# EAGLE design ConverterBoard (EAGLE 6.5.0)
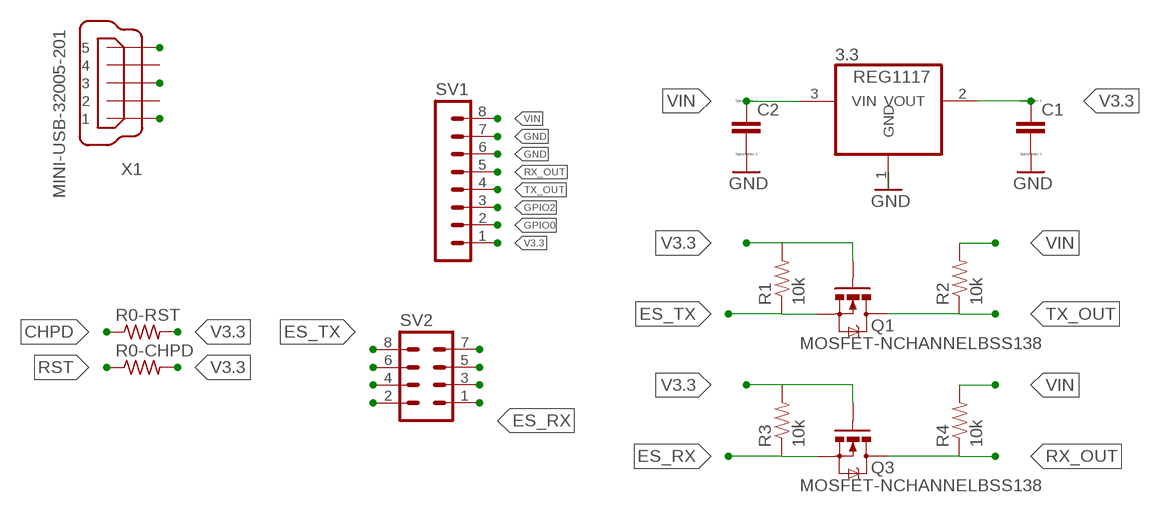
[diagram p0: schematic, sheet 1]

## Parts
3.3  REG1117  [SOT223]
C1  CC1808  [C1808]
C2  CC1808  [C1808]
Q1  MOSFET-NCHANNELBSS138  [SOT23-3]
Q3  MOSFET-NCHANNELBSS138  [SOT23-3]
R0-CHPD  R-US_R0603  [R0603]
R0-RST  R-US_R0603  [R0603]
R1  10k  RESISTOR0805-RES  [0805]
R2  10k  RESISTOR0805-RES  [0805]
R3  10k  RESISTOR0805-RES  [0805]
R4  10k  RESISTOR0805-RES  [0805]
SV1  MA08-1  [MA08-1]
SV2  MA04-2  [MA04-2]
X1  MINI-USB-32005-201  [32005-201]

## Nets
CHPD: R0-RST.1 SV2.6
ES_RX: Q3.2(S) R3.1 SV2.1
ES_TX: Q1.2(S) R1.1 SV2.8
GND: 3.3.1(GND) C1.2 C2.2 SV1.6 SV1.7 SV2.7 X1.5
GPIO0: SV1.2 SV2.3
GPIO2: SV1.3 SV2.5
N$3: X1.3
RST: R0-CHPD.1 SV2.4
RX_OUT: Q3.3(D) R4.1 SV1.5
TX_OUT: Q1.3(D) R2.1 SV1.4
V3.3: 3.3.2(VOUT) C1.1 Q1.1(G) Q3.1(G) R0-CHPD.2 R0-RST.2 R1.2 R3.2 SV1.1 SV2.2
VIN: 3.3.3(VIN) C2.1 R2.2 R4.2 SV1.8 X1.1
Unconnected: X1.2 X1.4

## Library data of the parts
3.3 = burr-brown:REG1117: 800mA and 1A Low Dropout (LDO) Positive Regulator 1.8V, 2.5V, 2.85V, 3.3V, 5V, and Adj; MPN: REG1117; OC_FARNELL: 1097566; OC_NEWARK: 14P6981
C1 C2 = eagle-ltspice:C: CAPACITOR, European symbol; SPICEMODEL: NONE; SPICEPREFIX: C
Q1 Q3 = SparkFun-DiscreteSemi:MOSFET-NCHANNEL: Common NMOSFET Parts MFG P/N Store ID Prod ID FDD8780 TRANS-09984 SI7820DN TRANS-11055 FDS6630A IC-08089 2N7002PW TRANS-11151 FQP30N06L COM-10213 TRANS-10060 BSS123LT1G TRANS-08345 BSS138 TRANS-00830 BS170 2N7000; PROD_ID: TRANS-00830
R0-CHPD R0-RST = resistor:R-US_: RESISTOR, American symbol
R1-R4 = SparkFun-Passives:RESISTOR: Resistor Basic schematic elements and footprints for 0603, 1206, and PTH resistors.
SV1 = con-lstb:MA08-1: PIN HEADER; OC_FARNELL: unknown; OC_NEWARK: unknown
SV2 = con-lstb:MA04-2: PIN HEADER; OC_FARNELL: unknown; OC_NEWARK: unknown
X1 = con-cypressindustries:MINI-USB-: MINI USB-B Conector Source: www.cypressindustries.com; OC_FARNELL: unknown; OC_NEWARK: unknown

## Board
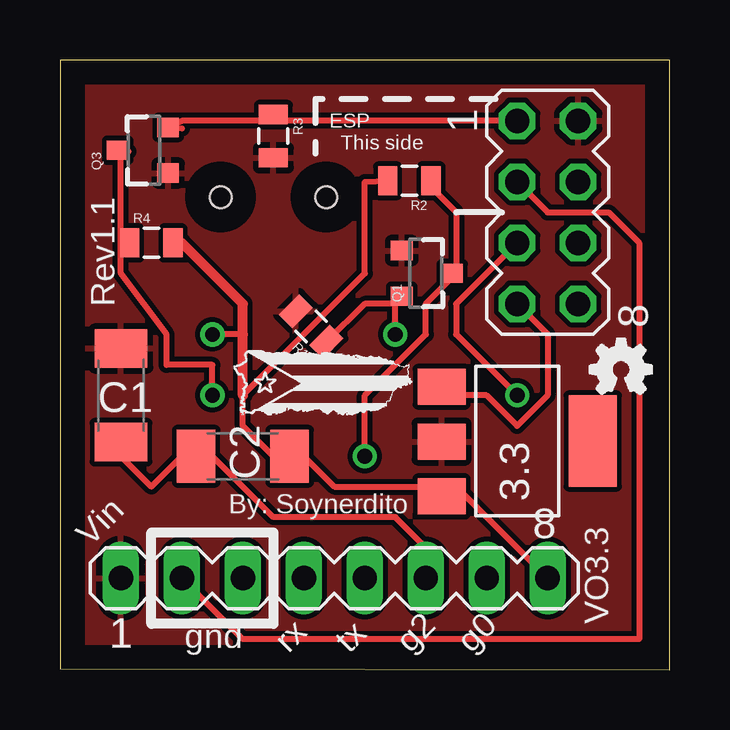
[diagram p1: board, top side]
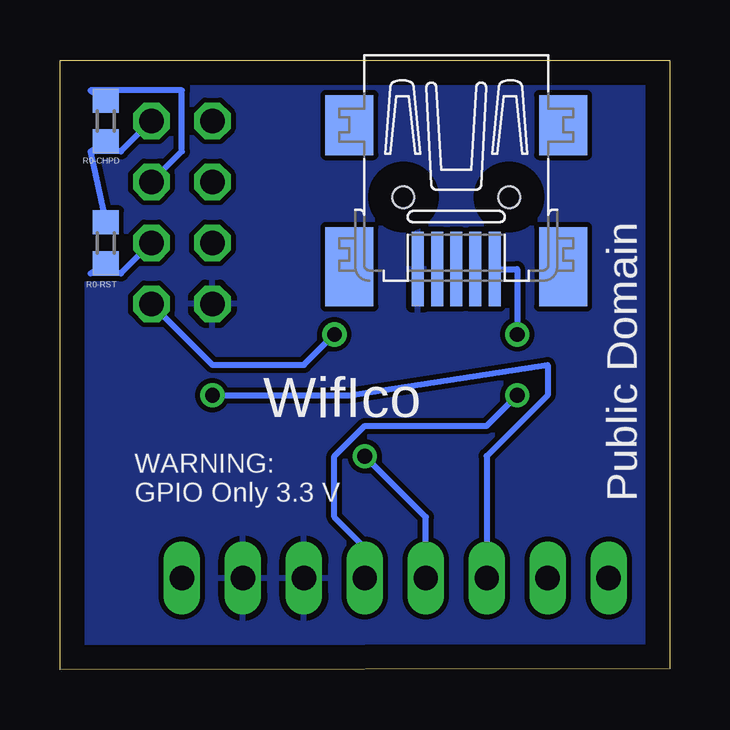
[diagram p2: board, bottom side, seen from below]

Size 25.4 x 25.4 mm. Coordinates in mm from the lower left corner, seen from the top.
Outline: 0,0.03 25.4,0 25.4,25.4 0,25.4 0,0.03
Copper layers (1*16): Top 0.035mm / dielectric 1.5mm / Bottom 0.035mm
Design rules "default": minimum track width 10mil, minimum drill 24mil, track to track 8mil, track to pad 8mil, pad to pad 8mil, via to via 8mil, smd to smd 8mil, copper to edge 40mil, drill to drill 8mil, minimum pad ring 10mil, minimum via ring 8mil, stop-mask expansion 4mil, vias tented up to drill 0mil, thermal gap 10mil

### Footprints (pad centres in the part's own frame; a part is rotated, then mirrored left to right if it is on the bottom)
SOT223 = smd 1.499 x 2.007: 1 -2.261,-3.15; 2 0.025,-3.15; 3 2.311,-3.15 | smd 3.81 x 2.007: 4 0,3.15
C1808 = smd 1.6 x 2.2: 1 -1.95,0; 2 1.95,0
SOT23-3 = smd 0.8 x 0.9: 1 -0.95,-1; 2 0.95,-1; 3 0,1.1
R0603 = smd 1 x 1.1: 1 -0.85,0; 2 0.85,0
0805 = smd 0.8 x 1.2: 1 -0.9,0; 2 0.9,0
MA08-1 = drill 1.016 long: 1 -8.89,0; 2 -6.35,0; 3 -3.81,0; 4 -1.27,0; 5 1.27,0; 6 3.81,0; 7 6.35,0; 8 8.89,0
MA04-2 = drill 1.016 octagon: 1 -3.81,-1.27; 2 -3.81,1.27; 3 -1.27,-1.27; 4 -1.27,1.27; 5 1.27,-1.27; 6 1.27,1.27; 7 3.81,-1.27; 8 3.81,1.27
32005-201 = smd 3.1 x 0.5: 1 3,1.6; 2 3,0.8; 3 3,0; 4 3,-0.8; 5 3,-1.6 | smd 2.5 x 2: M1 -3,-4.45; M2 -3,4.45 | smd 3.3 x 2: M3 2.9,4.45; M4 2.9,-4.45 | hole 0.9: 0,2.2; 0,-2.2

### Placement (x,y rotation side)
3.3  19.05,9.53 270 top
C1  2.54,11.43 270 top
C2  7.62,8.89 180 top
Q1  15.24,16.51 270 top
Q3  3.51,21.64 90 top
R0-CHPD  23.5,22.86 270 bottom
R0-RST  23.5,17.78 90 bottom
R1  10.46,14.3 135 top
R2  14.55,20.37 180 top
R3  8.89,22.23 270 top
R4  3.81,17.78 0 top
SV1  11.43,3.81 0 top
SV2  20.32,19.05 270 top
X1  8.89,19.68 270 bottom

### Tracks (layer width: path | path; a pad name or v marks a point on that pad's centre or on a via)
CHPD
  Bottom 0.254: SV2.6 22.86,16.51 24.13,16.51 R0-RST.1
ES_RX
  Top 0.254: 5.08,22.54 Q3.2 5.08,22.86 8.89,22.86 | SV2.1 8.89,22.86 | 8.89,22.86 R3.1
ES_TX  (via drill 0.61)
  Top 0.254: v13.97,13.97 13.97,15.24 | 13.97,15.24 12.7,15.24 R1.1 | 13.97,15.24 Q1.2
  Bottom 0.254: v13.97,13.97 15.24,12.7 19.05,12.7 SV2.8
GND
  Top 0.254: C1.2 2.54,8.89 3.81,7.62 5.08,8.89 C2.2 6.35,8.89 8.89,6.35 13.97,6.35 15.24,5.08 SV1.6 | SV2.7 20.32,13.97 20.32,11.43 19.05,10.16 17.78,11.43 16.51,11.43 3.3.1
  pour Bottom: 0,25.4 0,0 25.4,0 25.4,25.4
GPIO0
  Top 0.254: SV1.2 7.62,1.27 24.13,1.27 24.13,17.78 22.86,19.05 20.32,19.05 SV2.3
GPIO2  (via drill 0.61)
  Top 0.254: v19.05,11.43 16.51,13.97 16.51,15.24 SV2.5
  Bottom 0.254: SV1.3 7.62,8.89 5.08,11.43 5.08,12.7 13.34,11.43 v19.05,11.43
RST
  Bottom 0.254: SV2.4 20.32,21.59 20.32,24.13 24.13,24.13 R0-CHPD.1
RX_OUT  (via drill 0.61)
  Top 0.254: 2.86,21.59 Q3.3 2.54,21.59 2.54,17.78 | 2.86,17.78 R4.1 2.54,17.78 | 2.54,17.78 2.54,16.51 4.45,13.97 4.45,12.7 6.35,12.7 v6.35,11.43
  Bottom 0.254: v6.35,11.43 7.62,10.16 12.7,10.16 13.97,8.89 13.97,6.35 12.7,5.08 SV1.5
TX_OUT  (via drill 0.61)
  Top 0.254: 16.51,16.51 16.51,19.05 15.24,20.32 R2.1 | 16.51,16.51 15.24,15.24 15.24,13.97 12.7,11.43 v12.7,8.89 | 16.51,16.51 Q1.3
  Bottom 0.254: v12.7,8.89 10.16,6.35 SV1.4
V3.3
  Bottom 0.254: 24.13,21.59 R0-RST.2 | 24.13,21.59 22.86,21.59 SV2.2 | 24.13,21.59 R0-CHPD.2
  pour Top: 0,25.4 0,0 25.4,0 25.4,25.4
VIN  (via drill 0.61)
  Top 0.254: 5.08,17.78 R4.2 | R2.2 12.7,20.32 12.7,16.51 7.62,11.43 7.62,10.16 8.89,8.89 C2.1 10.16,8.89 11.43,7.62 15.24,7.62 3.3.3 16.51,7.62 SV1.8 | 7.62,13.97 v6.35,13.97
  Top 0.406: 5.08,17.78 7.62,15.24 7.62,13.97 7.62,11.43
  Bottom 0.254: X1.1 6.35,16.68 v6.35,13.97

### Text on the board
tPlace: ESP / This side | /home/choco/Pictures/OPenHardware/PR_flag_island.bmp | By: Soynerdito
bPlace: WifIco | WARNING: / GPIO Only 3.3 V
tNames: Rev1.1 | Vin | gnd | VO3.3 | rx | tx | g2 | g0
bNames: Public Domain